# Altium schematic sheet 485_termination.SchDoc: RS485 Termination
size Letter; Organization: OSURC Mars Rover; DocumentNumber: 1; Revision: 1; SheetNumber: 7; SheetTotal: 7
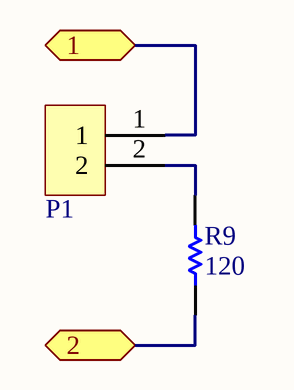
[diagram p0: 485_termination.SchDoc]

## Parts
P1  TE Connectivity 3-644456-2  [PCB-5yupddsicqn8qq7gr5lb-1]  (value not drawn)
R9  120  [RESC1609X50X30LL8T20]

## Ports
1 (bidir), 2 (bidir)

## Nets
1: P1.1 ; port 1
2: R9.1 ; port 2
NetP1_2: P1.2 R9.2

## Notes on the sheet
- Title
- Size:
- Date:
- Letter
- Number:
- Time:
- Revision:
- Sheet
- of
- File:

## Library data of the parts
P1 = CMP-2a80e1d15423f547-28: Headers & Receptacles cable a placa HPI., 2.5MM PITCH, V/T, SMT TYPE, 15 POS TYCO / TE CONNECTIVITY
R9 = CMP-1873454-4: Chip Resistor, 120 Ohm, +/- 1%, 100 mW, -55 to 155 degC, 0603 (1608 Metric), RoHS, Tape and Reel; Manufacturer Part Number: CRCW0603120RFKEA; Lead-Free Status: Lead Free; Resistance: 120 Ω; Case/Package (SI): 1608; Power Rating: 100 mW; Voltage Rating (DC): 75.0 V; Number of Pins: 2; ComponentLink2URL: http://www.farnell.com/datasheets/1533075.pdf; Size-Length: 1.55 mm; Mounting Style: Surface Mount; Seller Landing  Url: https://octopart.com/click/track?country=US&ak=8157f166&sig=0810659&sid=5822&ppid=39713744&vpid=257756095&ct=offers; ComponentLink1Description: Manufacturer URL; Case/Package: 0603; OctopartID: 7d1db64aa3aba2da; ComponentLink2Description: Datasheet; PackageReference: 0603; PackageDescription: 2-Pin Surface Mount Device, Body 1.575 x 0.85 mm; DatasheetVersion: Nov-10; Packaging: Tape & Reel (TR), Cut Tape (CT); Size-Width: 850 µm; Octopart Url: http://octopart.com/crcw0603120rfkea-vishay-39713744; REACH SVHC Compliance: No SVHC; Resistance Tolerance: ±1%; Size-Height: 450 µm; RoHS: Compliant; ComponentLink1URL: http://www.vishay.com/